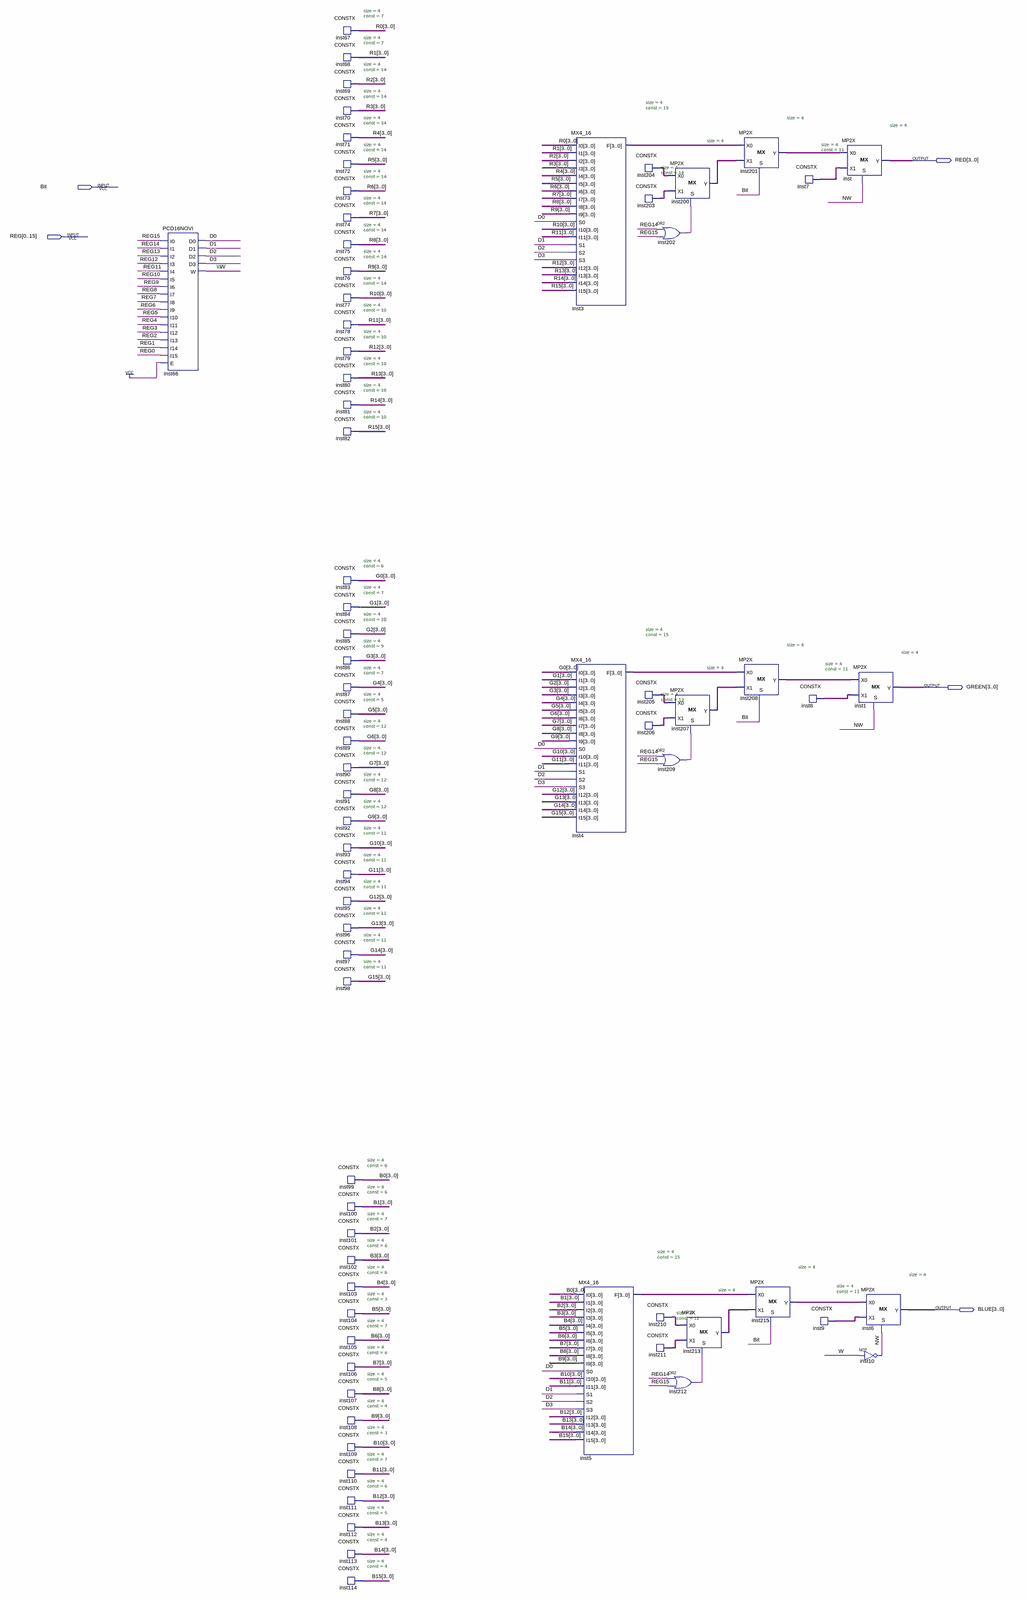
[diagram p0: schematic sheet, whole]
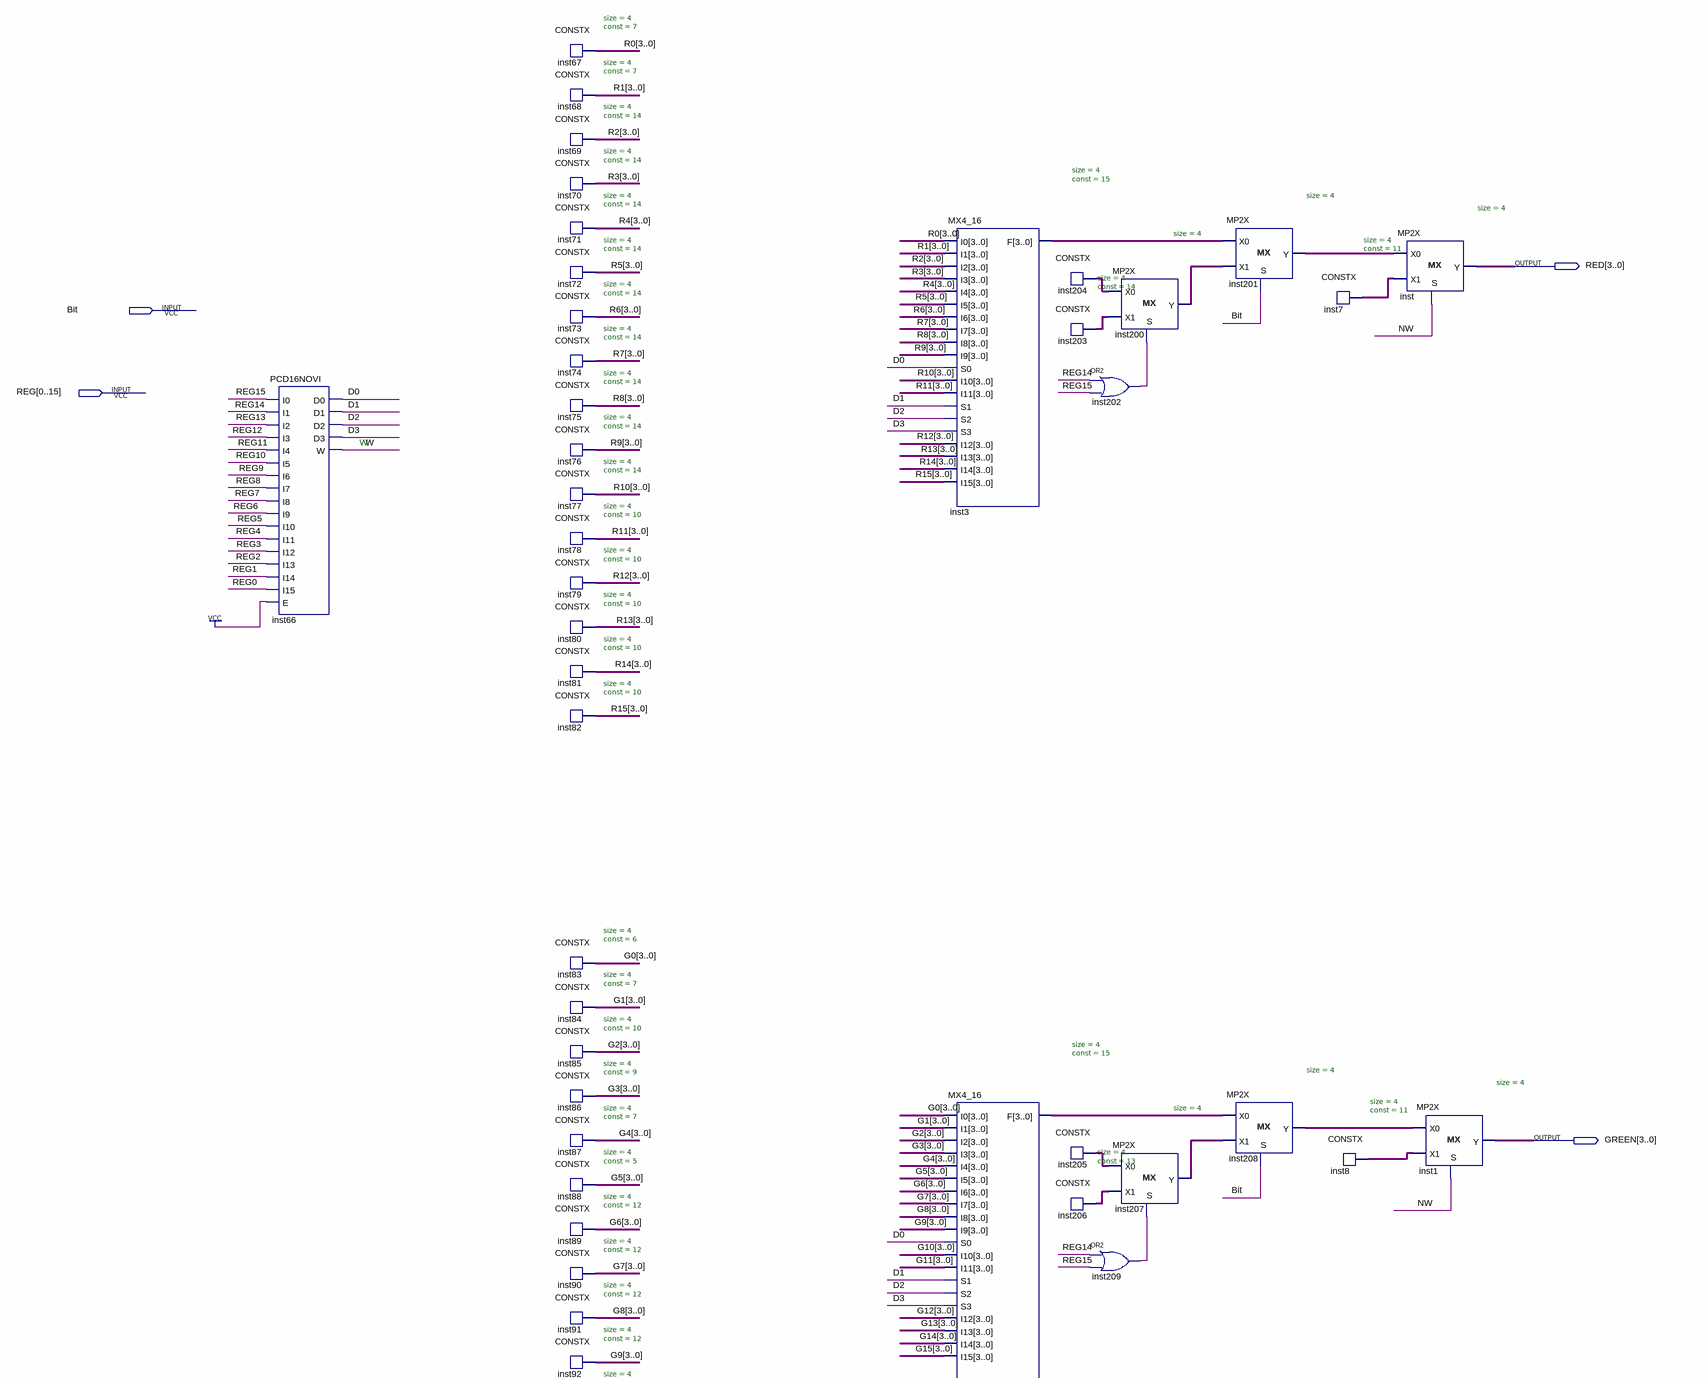
[diagram p1: schematic sheet, upper part]
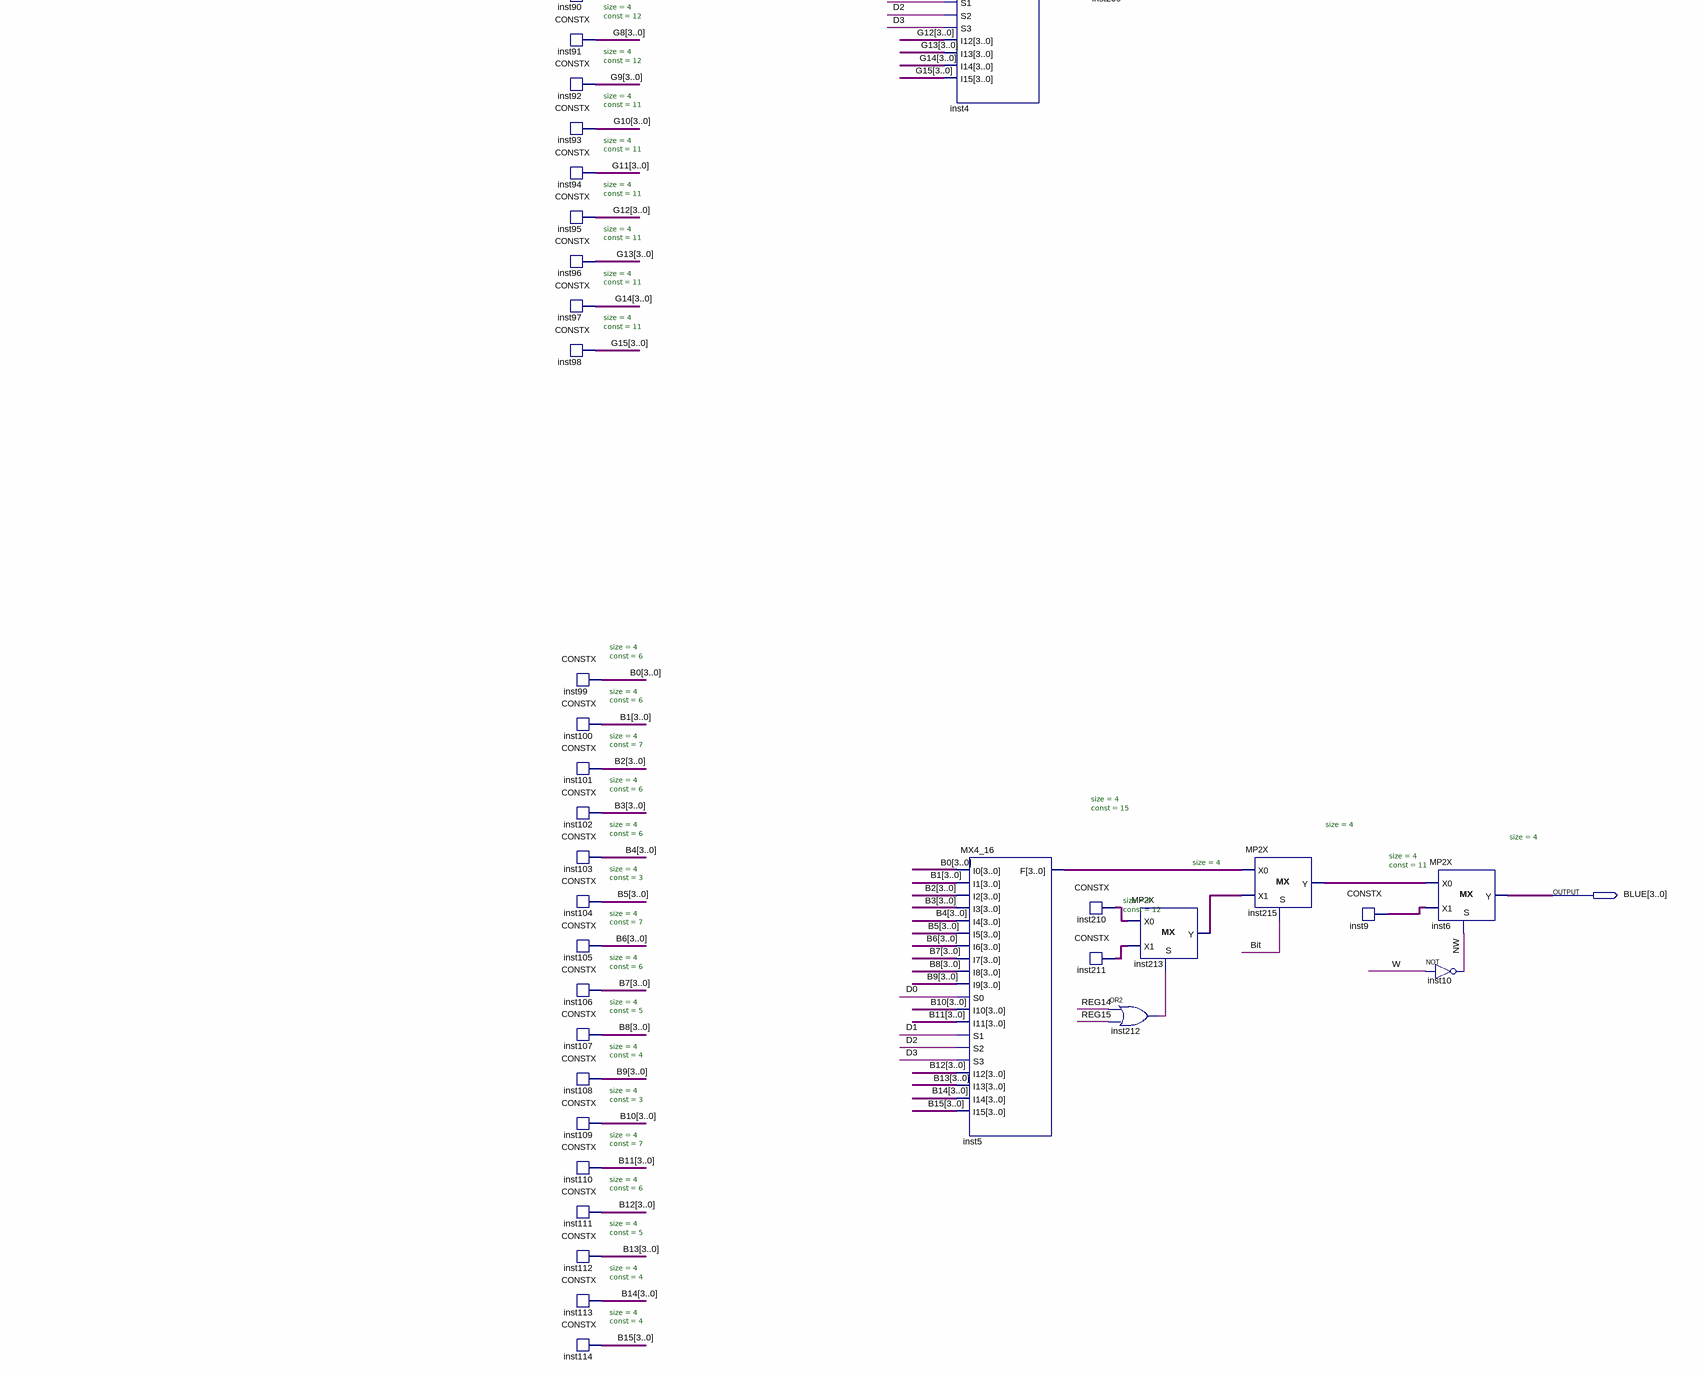
[diagram p2: schematic sheet, lower part]
// Quartus schematic GrafickiKoder.bdf as structural Verilog: 74 symbols, 5 pins
module GrafickiKoder (
  input  Bit,
  input  [0:15] REG,
  output [3:0] RED,
  output [3:0] GREEN,
  output [3:0] BLUE
);

  wire D0, D1, D2, D3, inst202_out, inst209_out, inst212_out, NW, W;
  wire [3:0] B0, B1, B2, B3, B4, B5, B6, B7, B8, B9, B10, B11, B12, B13, B14, B15, G0, G1, G2, G3, G4, G5,
       G6, G7, G8, G9, G10, G11, G12, G13, G14, G15, inst3_f, inst4_f, inst5_f, inst7_data, inst8_data,
       inst9_data, inst200_y, inst201_y, inst203_data, inst204_data, inst205_data, inst206_data, inst207_y,
       inst208_y, inst210_data, inst211_data, inst213_y, inst215_y, R0, R1, R2, R3, R4, R5, R6, R7, R8, R9,
       R10, R11, R12, R13, R14, R15;

  PCD16NOVI inst66 (
    .I0(REG[15]), .I1(REG[14]), .I2(REG[13]), .I3(REG[12]), .I4(REG[11]), .I5(REG[10]), .I6(REG[9]),
    .I7(REG[8]), .I8(REG[7]), .I9(REG[6]), .I10(REG[5]), .I11(REG[4]), .I12(REG[3]), .I13(REG[2]),
    .I14(REG[1]), .I15(REG[0]), .E(1'b1), .D0(D0), .D1(D1), .D2(D2), .D3(D3), .W(W));
  CONSTX #(.size(4), .\const (7)) inst67 (.data(R0));
  CONSTX #(.size(4), .\const (7)) inst68 (.data(R1));
  CONSTX #(.size(4), .\const (14)) inst69 (.data(R2));
  CONSTX #(.size(4), .\const (14)) inst70 (.data(R3));
  CONSTX #(.size(4), .\const (14)) inst71 (.data(R4));
  CONSTX #(.size(4), .\const (14)) inst72 (.data(R5));
  CONSTX #(.size(4), .\const (14)) inst73 (.data(R6));
  CONSTX #(.size(4), .\const (14)) inst74 (.data(R7));
  CONSTX #(.size(4), .\const (14)) inst75 (.data(R8));
  CONSTX #(.size(4), .\const (14)) inst76 (.data(R9));
  CONSTX #(.size(4), .\const (14)) inst77 (.data(R10));
  CONSTX #(.size(4), .\const (10)) inst78 (.data(R11));
  CONSTX #(.size(4), .\const (10)) inst79 (.data(R12));
  CONSTX #(.size(4), .\const (10)) inst80 (.data(R13));
  CONSTX #(.size(4), .\const (10)) inst81 (.data(R14));
  CONSTX #(.size(4), .\const (10)) inst82 (.data(R15));
  CONSTX #(.size(4), .\const (6)) inst83 (.data(G0));
  CONSTX #(.size(4), .\const (7)) inst84 (.data(G1));
  CONSTX #(.size(4), .\const (10)) inst85 (.data(G2));
  CONSTX #(.size(4), .\const (9)) inst86 (.data(G3));
  CONSTX #(.size(4), .\const (7)) inst87 (.data(G4));
  CONSTX #(.size(4), .\const (5)) inst88 (.data(G5));
  CONSTX #(.size(4), .\const (12)) inst89 (.data(G6));
  CONSTX #(.size(4), .\const (12)) inst90 (.data(G7));
  CONSTX #(.size(4), .\const (12)) inst91 (.data(G8));
  CONSTX #(.size(4), .\const (12)) inst92 (.data(G9));
  CONSTX #(.size(4), .\const (11)) inst93 (.data(G10));
  CONSTX #(.size(4), .\const (11)) inst94 (.data(G11));
  CONSTX #(.size(4), .\const (11)) inst95 (.data(G12));
  CONSTX #(.size(4), .\const (11)) inst96 (.data(G13));
  CONSTX #(.size(4), .\const (11)) inst97 (.data(G14));
  CONSTX #(.size(4), .\const (11)) inst98 (.data(G15));
  CONSTX #(.size(4), .\const (6)) inst99 (.data(B0));
  CONSTX #(.size(4), .\const (6)) inst100 (.data(B1));
  CONSTX #(.size(4), .\const (7)) inst101 (.data(B2));
  CONSTX #(.size(4), .\const (6)) inst102 (.data(B3));
  CONSTX #(.size(4), .\const (6)) inst103 (.data(B4));
  CONSTX #(.size(4), .\const (3)) inst104 (.data(B5));
  CONSTX #(.size(4), .\const (7)) inst105 (.data(B6));
  CONSTX #(.size(4), .\const (6)) inst106 (.data(B7));
  CONSTX #(.size(4), .\const (5)) inst107 (.data(B8));
  CONSTX #(.size(4), .\const (4)) inst108 (.data(B9));
  CONSTX #(.size(4), .\const (3)) inst109 (.data(B10));
  CONSTX #(.size(4), .\const (7)) inst110 (.data(B11));
  CONSTX #(.size(4), .\const (6)) inst111 (.data(B12));
  CONSTX #(.size(4), .\const (5)) inst112 (.data(B13));
  CONSTX #(.size(4), .\const (4)) inst113 (.data(B14));
  CONSTX #(.size(4), .\const (4)) inst114 (.data(B15));
  MX4_16 inst3 (
    .I0(R0), .I1(R1), .I2(R2), .I3(R3), .I4(R4), .I5(R5), .I6(R6), .I7(R7), .I8(R8), .I9(R9), .S0(D0),
    .I10(R10), .I11(R11), .S1(D1), .S2(D2), .S3(D3), .I12(R12), .I13(R13), .I14(R14), .I15(R15), .F(inst3_f));
  MX4_16 inst4 (
    .I0(G0), .I1(G1), .I2(G2), .I3(G3), .I4(G4), .I5(G5), .I6(G6), .I7(G7), .I8(G8), .I9(G9), .S0(D0),
    .I10(G10), .I11(G11), .S1(D1), .S2(D2), .S3(D3), .I12(G12), .I13(G13), .I14(G14), .I15(G15), .F(inst4_f));
  MX4_16 inst5 (
    .I0(B0), .I1(B1), .I2(B2), .I3(B3), .I4(B4), .I5(B5), .I6(B6), .I7(B7), .I8(B8), .I9(B9), .S0(D0),
    .I10(B10), .I11(B11), .S1(D1), .S2(D2), .S3(D3), .I12(B12), .I13(B13), .I14(B14), .I15(B15), .F(inst5_f));
  CONSTX #(.size(4), .\const (15)) inst204 (.data(inst204_data));
  CONSTX #(.size(4), .\const (14)) inst203 (.data(inst203_data));
  CONSTX #(.size(4), .\const (15)) inst205 (.data(inst205_data));
  CONSTX #(.size(4), .\const (13)) inst206 (.data(inst206_data));
  CONSTX #(.size(4), .\const (15)) inst210 (.data(inst210_data));
  CONSTX #(.size(4), .\const (12)) inst211 (.data(inst211_data));
  MP2X #(.size(4)) inst200 (.S(inst202_out), .X0(inst204_data), .X1(inst203_data), .Y(inst200_y));
  or inst202 (inst202_out, REG[14], REG[15]);
  MP2X #(.size(4)) inst207 (.S(inst209_out), .X0(inst205_data), .X1(inst206_data), .Y(inst207_y));
  or inst209 (inst209_out, REG[14], REG[15]);
  or inst212 (inst212_out, REG[14], REG[15]);
  MP2X #(.size(4)) inst213 (.S(inst212_out), .X0(inst210_data), .X1(inst211_data), .Y(inst213_y));
  MP2X #(.size(4)) inst201 (.S(Bit), .X0(inst3_f), .X1(inst200_y), .Y(inst201_y));
  MP2X #(.size(4)) inst208 (.S(Bit), .X0(inst4_f), .X1(inst207_y), .Y(inst208_y));
  MP2X #(.size(4)) inst215 (.S(Bit), .X0(inst5_f), .X1(inst213_y), .Y(inst215_y));
  CONSTX #(.size(4), .\const (11)) inst7 (.data(inst7_data));
  CONSTX #(.size(4), .\const (11)) inst8 (.data(inst8_data));
  CONSTX #(.size(4), .\const (11)) inst9 (.data(inst9_data));
  MP2X #(.size(4)) inst (.S(NW), .X0(inst201_y), .X1(inst7_data), .Y(RED));
  MP2X #(.size(4)) inst1 (.S(NW), .X0(inst208_y), .X1(inst8_data), .Y(GREEN));
  MP2X #(.size(4)) inst6 (.S(NW), .X0(inst215_y), .X1(inst9_data), .Y(BLUE));
  not inst10 (NW, W);

  // Notes on the sheet:
  //   W
endmodule
